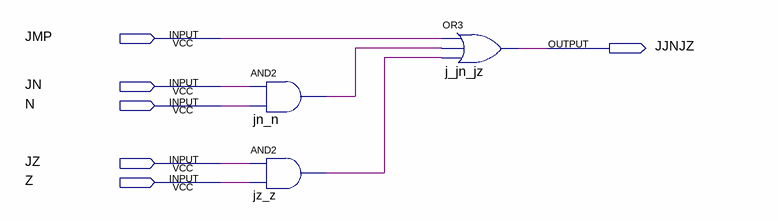
[diagram p0: schematic sheet]
// Quartus schematic JJNJZ.bdf as structural Verilog: 3 symbols, 6 pins
module JJNJZ (
  input  JMP,
  input  JN,
  input  N,
  input  JZ,
  input  Z,
  output JJNJZ
);

  wire jn_n_out, jz_z_out;

  and jn_n (jn_n_out, JN, N);
  and jz_z (jz_z_out, JZ, Z);
  or j_jn_jz (JJNJZ, JMP, jn_n_out, jz_z_out);
endmodule
